# EAGLE design Switch(P) (EAGLE 6.1)
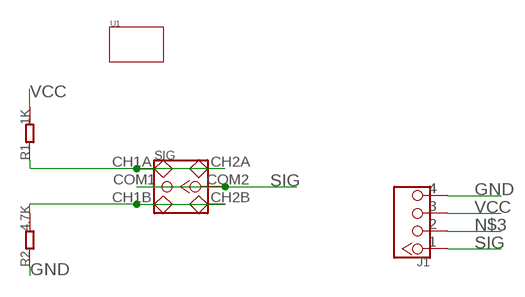
[diagram p0: schematic, sheet 1]

## Parts
J1  TWIG-4P-2.0-2.0  [4P-2.0]
R1  1K  R-0603  [0603]
R2  4.7K  R-0603  [0603]
SIG  SWITCH-2CH-6P  [6P-2CH-2.54-7.6X3.0]
U1  TWIG-1U  [1U-DIM-W/-DRILL]

## Nets
GND: J1.4 R2.1
N$1: R1.1 SIG.CH1A SIG.CH2A
N$2: R2.2 SIG.CH1B SIG.CH2B
N$3: J1.2
SIG: J1.1 SIG.COM1 SIG.COM2
VCC: J1.3 R1.2

## Library data of the parts
J1 = Connector:TWIG-4P-2.0
R1 R2 = Discrete:R*
SIG = Discrete:SWITCH-2CH-6P
U1 = Module:TWIG

## Board
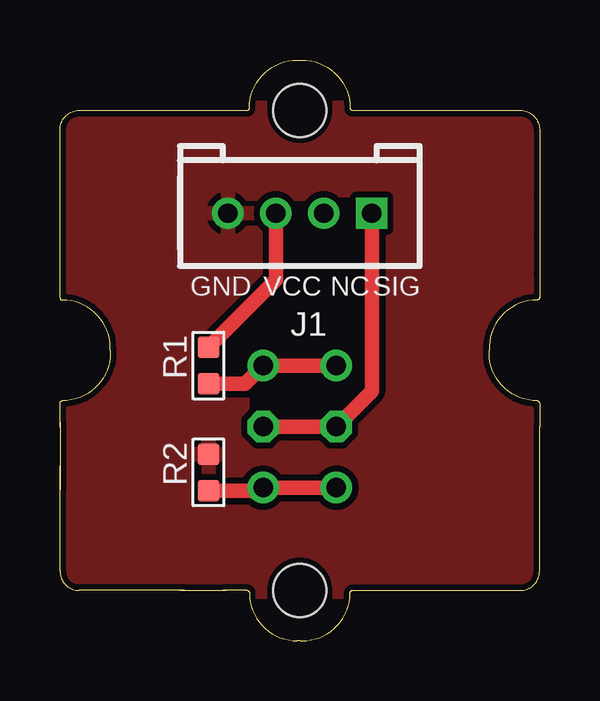
[diagram p1: board, top side]
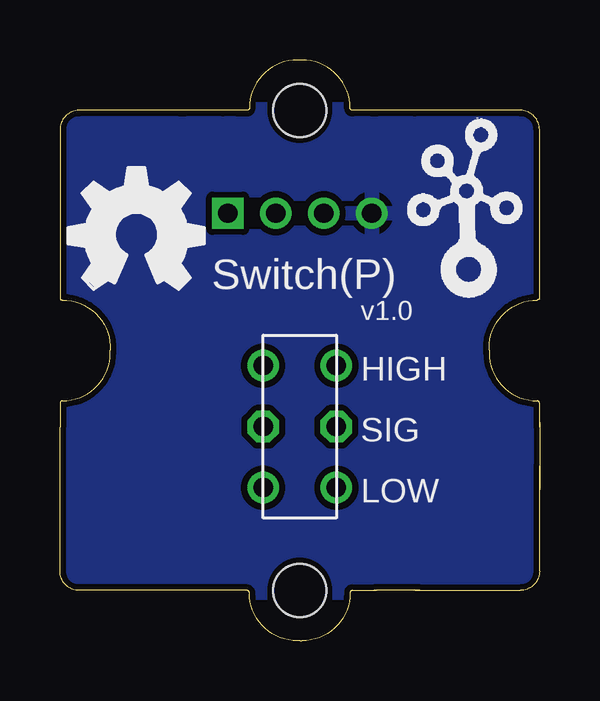
[diagram p2: board, bottom side, seen from below]

Size 20 x 24.2 mm. Coordinates in mm from the lower left corner, seen from the top.
Copper layers (1*16): Top 0.035mm / dielectric 1.5mm / Bottom 0.035mm
Design rules: minimum track width 10mil, minimum drill 12mil, track to track 8mil, track to pad 8mil, pad to pad 8mil, via to via 8mil, smd to smd 8mil, copper to edge 10mil, drill to drill 8mil, minimum pad ring 10mil, minimum via ring 8mil, stop-mask expansion 4mil, vias tented up to drill 100mil, thermal gap 10mil

### Footprints (pad centres in the part's own frame; a part is rotated, then mirrored left to right if it is on the bottom)
4P-2.0 = drill 0.8 pad 1.27 square: 1 -3,0 | drill 0.8 pad 1.27: 2 -1,0; 3 1,0; 4 3,0
0603 = smd 0.889 x 0.889: 1 -0.762,0; 2 0.762,0
6P-2CH-2.54-7.6X3.0 = drill 0.813 pad 1.27: CH1A -1.524,2.54; CH1B -1.524,-2.54; CH2A 1.524,2.54; CH2B 1.524,-2.54 | drill 0.813 pad 1.27 octagon: COM1 -1.524,0; COM2 1.524,0
1U-DIM-W/-DRILL = hole 2.2: 0,-10; 0,10

### Placement (x,y rotation side)
J1  10,17.82 180 top
R1  6.19,11.46 90 top
R2  6.19,7.02 270 top
SIG  10,8.93 0 bottom
U1  10,12.1 0 top
U$1  [TWIGLOGO]  3.02,15.28 0 bottom
U$2  [OSHW_FILLX200_NOTEXT]  19.65,14.64 0 bottom

### Tracks (layer width: path | path; a pad name or v marks a point on that pad's centre or on a via)
GND
  pour Bottom (isolate 0.254): -0.16,24.8 20.16,24.8 20.16,-0.6 -0.16,-0.6
  pour Top (isolate 0.254): -0.16,24.8 20.16,24.8 20.16,-0.6 -0.16,-0.6
N$1
  Top 0.61: R1.1 7.71,10.7 SIG.CH2A SIG.CH1A
N$2
  Top 0.61: R2.2 8.35,6.26 SIG.CH2B SIG.CH1B
SIG
  Top 0.61: SIG.COM2 SIG.COM1 13,10.4 J1.1
VCC
  Top 0.61: J1.3 9,15.04 R1.2

### Text on the board
tPlace: GND | VCC | NC | SIG
bPlace: Switch(P) | v1.0 | HIGH | LOW